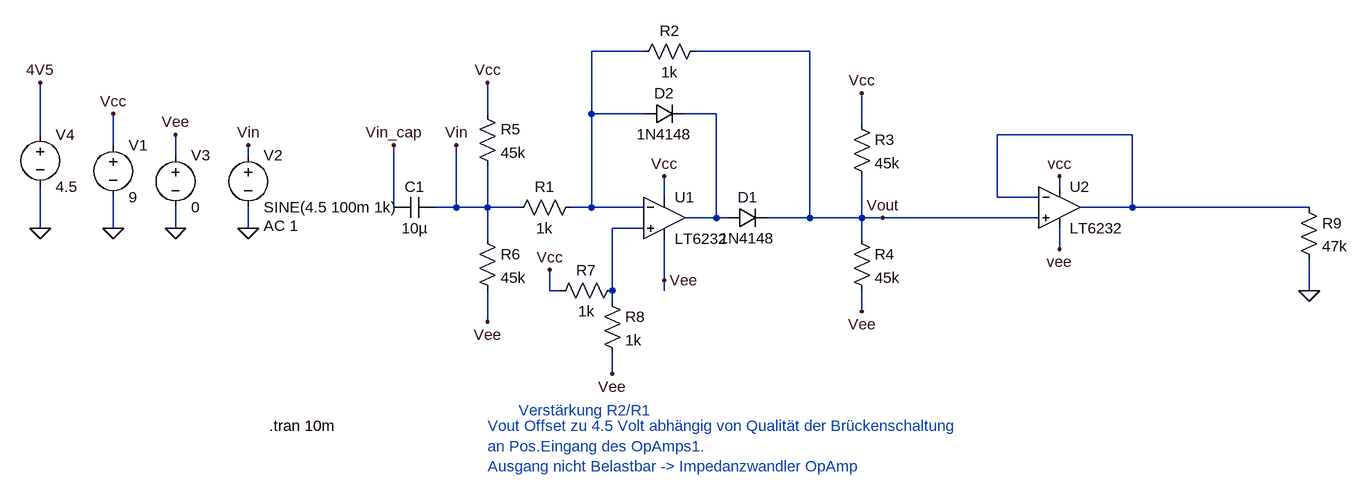
[diagram p0: schematic PraezisionsEinweggleichrichterTest1.asc]
PraezisionsEinweggleichrichterTest1.asc, the LTspice schematic file:
Version 4
SHEET 1 1296 680
WIRE 128 -80 48 -80
WIRE 384 -80 208 -80
WIRE -112 16 -112 -32
WIRE 48 16 48 -80
WIRE 128 16 48 16
WIRE 240 16 192 16
WIRE 464 32 464 -16
WIRE -800 48 -800 -32
WIRE 880 48 672 48
WIRE -688 64 -688 16
WIRE -592 80 -592 48
WIRE -480 80 -480 64
WIRE 768 128 768 112
WIRE 160 144 160 112
WIRE 672 144 672 48
WIRE 736 144 672 144
WIRE -256 160 -256 64
WIRE -160 160 -160 64
WIRE -160 160 -192 160
WIRE -112 160 -112 96
WIRE -112 160 -160 160
WIRE -64 160 -112 160
WIRE 48 160 48 16
WIRE 48 160 16 160
WIRE 128 160 48 160
WIRE 880 160 880 48
WIRE 880 160 800 160
WIRE 1152 160 880 160
WIRE 240 176 240 16
WIRE 240 176 192 176
WIRE 256 176 240 176
WIRE 384 176 384 -80
WIRE 384 176 320 176
WIRE 464 176 464 112
WIRE 464 176 384 176
WIRE 496 176 464 176
WIRE 736 176 496 176
WIRE -800 192 -800 128
WIRE -688 192 -688 144
WIRE -592 192 -592 160
WIRE -480 192 -480 160
WIRE 128 192 80 192
WIRE -112 208 -112 160
WIRE 464 208 464 176
WIRE 768 224 768 192
WIRE 160 272 160 208
WIRE -16 288 -16 256
WIRE 0 288 -16 288
WIRE 80 288 80 192
WIRE 160 288 160 272
WIRE 1152 288 1152 240
WIRE 80 304 80 288
WIRE 464 320 464 288
WIRE -112 336 -112 288
WIRE 80 416 80 384
FLAG -688 192 0
FLAG -592 48 Vee
FLAG -688 16 Vcc
FLAG -480 192 0
FLAG -480 64 Vin
FLAG 496 176 Vout
FLAG 160 112 Vcc
FLAG 160 272 Vee
FLAG -112 336 Vee
FLAG 464 320 Vee
FLAG -112 -32 Vcc
FLAG 464 -16 Vcc
FLAG -592 192 0
FLAG -16 256 Vcc
FLAG 80 416 Vee
FLAG -800 192 0
FLAG -800 -32 4V5
FLAG -256 64 Vin_cap
FLAG -160 64 Vin
FLAG 768 224 vee
FLAG 768 112 vcc
FLAG 1152 288 0
SYMBOL Opamps\\LT6232 160 176 R0
SYMATTR InstName U1
SYMBOL voltage -688 48 R0
WINDOW 123 0 0 Left 2
WINDOW 39 0 0 Left 2
SYMATTR InstName V1
SYMATTR Value 9
SYMBOL voltage -480 64 R0
WINDOW 123 24 124 Left 2
WINDOW 39 24 124 Left 2
SYMATTR Value2 AC 1
SYMATTR InstName V2
SYMATTR Value SINE(4.5 100m 1k)
SYMBOL res -80 176 R270
WINDOW 0 32 56 VTop 2
WINDOW 3 0 56 VBottom 2
SYMATTR InstName R1
SYMATTR Value 1k
SYMBOL diode 256 192 R270
WINDOW 0 32 32 VTop 2
WINDOW 3 0 32 VBottom 2
SYMATTR InstName D1
SYMATTR Value 1N4148
SYMBOL diode 128 32 R270
WINDOW 0 32 32 VTop 2
WINDOW 3 0 32 VBottom 2
SYMATTR InstName D2
SYMATTR Value 1N4148
SYMBOL res 112 -64 R270
WINDOW 0 32 56 VTop 2
WINDOW 3 0 56 VBottom 2
SYMATTR InstName R2
SYMATTR Value 1k
SYMBOL res 448 16 R0
SYMATTR InstName R3
SYMATTR Value 45k
SYMBOL res 448 192 R0
SYMATTR InstName R4
SYMATTR Value 45k
SYMBOL res -128 0 R0
SYMATTR InstName R5
SYMATTR Value 45k
SYMBOL res -128 192 R0
SYMATTR InstName R6
SYMATTR Value 45k
SYMBOL voltage -592 64 R0
WINDOW 123 0 0 Left 2
WINDOW 39 0 0 Left 2
SYMATTR InstName V3
SYMATTR Value 0
SYMBOL res -16 304 R270
WINDOW 0 32 56 VTop 2
WINDOW 3 0 56 VBottom 2
SYMATTR InstName R7
SYMATTR Value 1k
SYMBOL res 64 288 R0
SYMATTR InstName R8
SYMATTR Value 1k
SYMBOL voltage -800 32 R0
WINDOW 123 0 0 Left 2
WINDOW 39 0 0 Left 2
SYMATTR InstName V4
SYMATTR Value 4.5
SYMBOL cap -192 144 R90
WINDOW 0 0 32 VBottom 2
WINDOW 3 32 32 VTop 2
SYMATTR InstName C1
SYMATTR Value 10µ
SYMBOL Opamps\\LT6232 768 160 R0
SYMATTR InstName U2
SYMBOL res 1136 144 R0
SYMATTR InstName R9
SYMATTR Value 47k
TEXT -64 472 Left 2 ;Verstärkung R2/R1
TEXT -448 496 Left 2 !.tran 10m
TEXT -112 496 Left 2 ;Vout Offset zu 4.5 Volt abhängig von Qualität der Brückenschaltung \nan Pos.Eingang des OpAmps1.\nAusgang nicht Belastbar -> Impedanzwandler OpAmp

The netlist it stands for:
* PraezisionsEinweggleichrichterTest1.asc
* U1: LT6232 (symbol Opamps\LT6232 not available, pins judged from their places): In+=N004 In-=N001 V+=Vcc V-=Vee OUT=N002
V1 Vcc 0 9
V2 Vin 0 SINE(4.5 100m 1k) AC 1
R1 Vin N001 1k
D1 N002 Vout 1N4148
D2 N001 N002 1N4148
R2 N001 Vout 1k
R3 Vcc Vout 45k
R4 Vout Vee 45k
R5 Vcc Vin 45k
R6 Vin Vee 45k
V3 Vee 0 0
R7 Vcc N004 1k
R8 N004 Vee 1k
V4 4V5 0 4.5
C1 Vin Vin_cap 10µ
* U2: LT6232 (symbol Opamps\LT6232 not available, pins judged from their places): In+=Vout In-=N003 V+=Vcc V-=Vee OUT=N003
R9 N003 0 47k
.model D D
.lib standard.dio
* Verstärkung R2/R1
.tran 10m
* Vout Offset zu 4.5 Volt abhängig von Qualität der Brückenschaltung
* an Pos.Eingang des OpAmps1.
* Ausgang nicht Belastbar -> Impedanzwandler OpAmp
.backanno
.end